# Altium project PIF_robot.PrjPcb
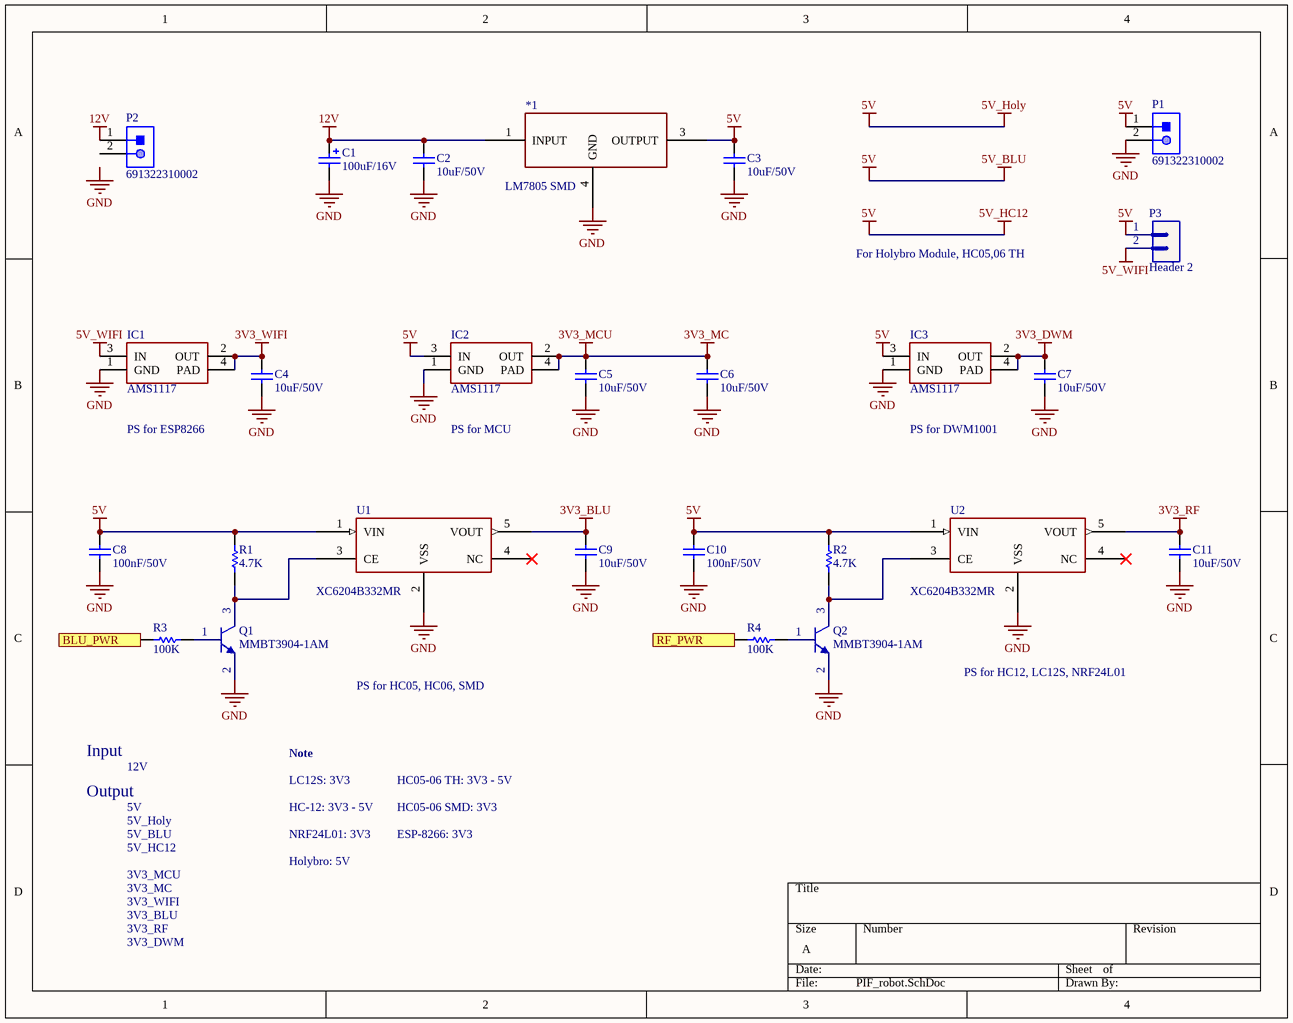
[diagram p0: PIF_robot.SchDoc]
7 sheets, 123 parts. Net scope: flat (ports and power ports of the same name join across sheets).
Board file: PIF_robot.PcbDoc
Sheets:
  PIF_robot.SchDoc
  wifi.SchDoc
  Decawave.schdoc
  Motor Control.SchDoc
  RF.SchDoc
  Sensor.SchDoc
  XCBMPUSche.schdoc

## Sheet PIF_robot.SchDoc
size A

### Parts
*1  LM7805 SMD  [LM7805 SMD]
C1  value 100uF/16V  [CAP-SM-AL-SIZE-D-D6L6]  (hidden comment: Cap-Al-100uF-16V-D6L5)
C2  value 10uF/50V  [CAP-SM-0805]  (hidden comment: Cap-10uF-50V-0805)
C3  value 10uF/50V  [CAP-SM-0805]  (hidden comment: Cap-10uF-50V-0805)
C4  value 10uF/50V  [CAP-SM-0805]  (hidden comment: Cap-10uF-50V-0805)
C5  value 10uF/50V  [CAP-SM-0805]  (hidden comment: Cap-10uF-50V-0805)
C6  value 10uF/50V  [CAP-SM-0805]  (hidden comment: Cap-10uF-50V-0805)
C7  value 10uF/50V  [CAP-SM-0805]  (hidden comment: Cap-10uF-50V-0805)
C8  value 100nF/50V  [CAP-SM-0805]  (hidden comment: Cap-100nF-50V-0805)
C9  value 10uF/50V  [CAP-SM-0805]  (hidden comment: Cap-10uF-50V-0805)
C10  value 100nF/50V  [CAP-SM-0805]  (hidden comment: Cap-100nF-50V-0805)
C11  value 10uF/50V  [CAP-SM-0805]  (hidden comment: Cap-10uF-50V-0805)
IC1  AMS1117  [SOT223]
IC2  AMS1117  [SOT223]
IC3  AMS1117  [SOT223]
P1  691322310002  [691322310002]
P2  691322310002  [691322310002]
P3  Header 2  [JP2]
Q1  MMBT3904-1AM  [SOT23_NEX]
Q2  MMBT3904-1AM  [SOT23_NEX]
R1  value 4.7K  [RES-SM-0805]  (hidden comment: Res-4.7K-0805)
R2  value 4.7K  [RES-SM-0805]  (hidden comment: Res-4.7K-0805)
R3  value 100K  [RES-SM-0805]  (hidden comment: Res-100K-0805)
R4  value 100K  [RES-SM-0805]  (hidden comment: Res-100K-0805)
U1  XC6204B332MR  [XC6204/05_SOT-00]
U2  XC6204B332MR  [XC6204/05_SOT-00]

### Ports
BLU_PWR (in), RF_PWR (in)

### Nets
3V3_BLU: C9.2 U1.5(VOUT)
3V3_DWM: C7.2 IC3.2(OUT) IC3.4(PAD)
3V3_MC: C5.2 C6.2 IC2.2(OUT) IC2.4(PAD)  [also labelled 3V3_MCU]
3V3_RF: C11.2 U2.5(VOUT)
3V3_WIFI: C4.2 IC1.2(OUT) IC1.4(PAD)
5V: *1.3(OUTPUT) C3.2 C8.2 C10.2 IC2.3(IN) IC3.3(IN) P1.1 P3.1 R1.2 R2.2 U1.1(VIN) U2.1(VIN)  [also labelled 5V_BLU, 5V_HC12, 5V_Holy]
5V_WIFI: IC1.3(IN) P3.2
12V: *1.1(INPUT) C1.1 C2.1 P2.1
GND: *1.4(GND) C1.2 C2.2 C3.1 C4.1 C5.1 C6.1 C7.1 C8.1 C9.1 C10.1 C11.1 IC1.1(GND) IC2.1(GND) IC3.1(GND) P1.2 Q1.2(E) Q2.2(E) U1.2(VSS) U2.2(VSS)
NetQ1_1: Q1.1(B) R3.2
NetQ1_3: Q1.3(C) R1.1 U1.3(CE)
NetQ2_1: Q2.1(B) R4.2
NetQ2_3: Q2.3(C) R2.1 U2.3(CE)
NetR3_1: R3.1 ; port BLU_PWR
NetR4_1: R4.1 ; port RF_PWR

Not connected (* = marked no-connect by the designer): P2 2; U1 4(NC)*; U2 4(NC)*

### Notes on the sheet
- For Holybro Module, HC05,06 TH
- PS for ESP8266
- PS for MCU
- PS for DWM1001
- PS for HC05, HC06, SMD
- PS for HC12, LC12S, NRF24L01
- Input
- 12V
- Note
- Output
- 5V_Holy
- 5V_BLU
- 5V
- LC12S: 3V3
- HC-12: 3V3 - 5V
- NRF24L01: 3V3
- HC05-06 TH: 3V3 - 5V
- HC05-06 SMD: 3V3
- ESP-8266: 3V3
- 5V_HC12
- 3V3_MC
- 3V3_MCU
- 3V3_WIFI
- Holybro: 5V
- 3V3_BLU
- 3V3_RF
- 3V3_DWM
- Labels drawn without touching a wire or pin: GND

### Library data of the parts
C1 = Cap-Al-100uF-16V-D6L5: CAP ALUM 100UF 20% 16V SMD; Manufacturer: Nichicon; Manufacturer Part Number: UWX1C101MCL1GB; Local Supplier: thegioiic; Local Supplier Link: https://thegioiic.com/products/tu-nhom-smd-100uf-16v-d6-3l5-4; Supplier 1: Digikey; Supplier 1 Part Number: 493-2105-1-ND; Supplier 1 Link: https://www.digikey.com/product-detail/en/nichicon/UWX1C101MCL1GB/493-2105-1-ND/590080
C2-C7 C9 C11 = Cap-10uF-50V-0805: CAP CER 10UF 50V X5R 0805; Manufacturer: Yageo; Manufacturer Part Number: CC0805KKX5R9BB106; Local Supplier: thegioiic; Local Supplier Link: https://thegioiic.com/products/tu-10uf-50v-0805; Supplier 1: Digikey; Supplier 1 Link: https://www.digikey.com/product-detail/en/yageo/CC0805KKX5R9BB106/311-3499-2-ND/7164383; Supplier 1 Part Number: 311-3499-2-ND
C8 C10 = Cap-100nF-50V-0805: CAP CER 0.1UF 50V Y5V 0805; Manufacturer: Samsung Electro-Mechanics; Manufacturer Part Number: CL21F104ZBCNNNC; Local Supplier: thegioiic; Local Supplier Link: https://thegioiic.com/products/tu-100nf-0-1uf-50v-0805; Supplier 1: Digikey; Supplier 1 Part Number: 1276-1007-1-ND; Supplier 1 Link: https://www.digikey.com/product-detail/en/samsung-electro-mechanics/CL21F104ZBCNNNC/1276-1007-1-ND/3889093
IC1-IC3 = AMS1117: Available in 1.8V, 2.5V, 2.85V, 3.3V, 5V, and  Adjustable Versions; Value: LM317
P1 P2 = 691322310002: WR-TBL Serie 322 Horizontal PCB Header, Pluggable, pitch 3.81mm, 2p; Compliance: RoHS; Modularity: No; Pin Number: 2; Rated Current [UL]: 10A; Working Voltage [UL]: 300VAC; ComponentLink1Description: Manufacturer; ComponentLink1URL: http://www.we-online.de; ComponentLink2URL: https://katalog.we-online.de/em/datasheet/691322310002.pdf; ComponentLink2Description: Datasheet; Mounting Technology: THT; Part Number: 691322310002; Packaging: Box; Operating Temperature: -40 to +105degC; PCB/Cable/Panel: PCB; Pitch: 3.81mm; Published Date: October 2019; Type: Horizontal; Publisher: Wurth Elektronik; Application: Pluggable
P3 = Header 2: Header, 2-Pin; LatestRevisionDate: 17-Jul-2002; LatestRevisionNote: Re-released for DXP Platform.; Publisher: Altium Limited
R1 R2 = Res-4.7K-0805: RES SMD 4.7K OHM 5% 1/8W 0805; Manufacturer: Yageo; Manufacturer Part Number: RC0805JR-074K7L; Local Supplier: thegioiic; Local Supplier Link: https://thegioiic.com/products/dien-tro-4-7k-ohm-0805-5; Supplier 1: Digikey; Supplier 1 Link: https://www.digikey.com/product-detail/en/yageo/RC0805JR-074K7L/311-4.7KARCT-ND/731274; Supplier 1 Part Number: 311-4.7KARCT-ND
R3 R4 = Res-100K-0805: RES 0 OHM JUMPER 0805; Manufacturer: Vishay Dale; Manufacturer Part Number: WSL080500000ZEA9; Local Supplier: thegioiic; Local Supplier Link: https://thegioiic.com/products/dien-tro-0-ohm-0805-5; Supplier 1: Digikey; Supplier 1 Link: https://www.digikey.com/product-detail/en/vishay-dale/WSL080500000ZEA9/541-3928-1-ND/7423223; Supplier 1 Part Number: 541-3928-1-ND
U1 U2 = XC6204B332MR: Vendor: Torex Semiconductor; Built_By: EMA_UL_Team; SourceLibrary: Torex_2016-07-05_1; Manufacturer_Part_Number: XC6204B332MR; Copyright: Copyright (C) 2018 Accelerated Designs. All rights reserved; RefDes: RefDes; Type: DEV
*1 = LM7805 SMD: Local Supplier: *; Local Supplier Link: *; Local Supplier Part Number: *; Mannufacture: *; Mannufacture Part Number: *

## Sheet wifi.SchDoc
size A
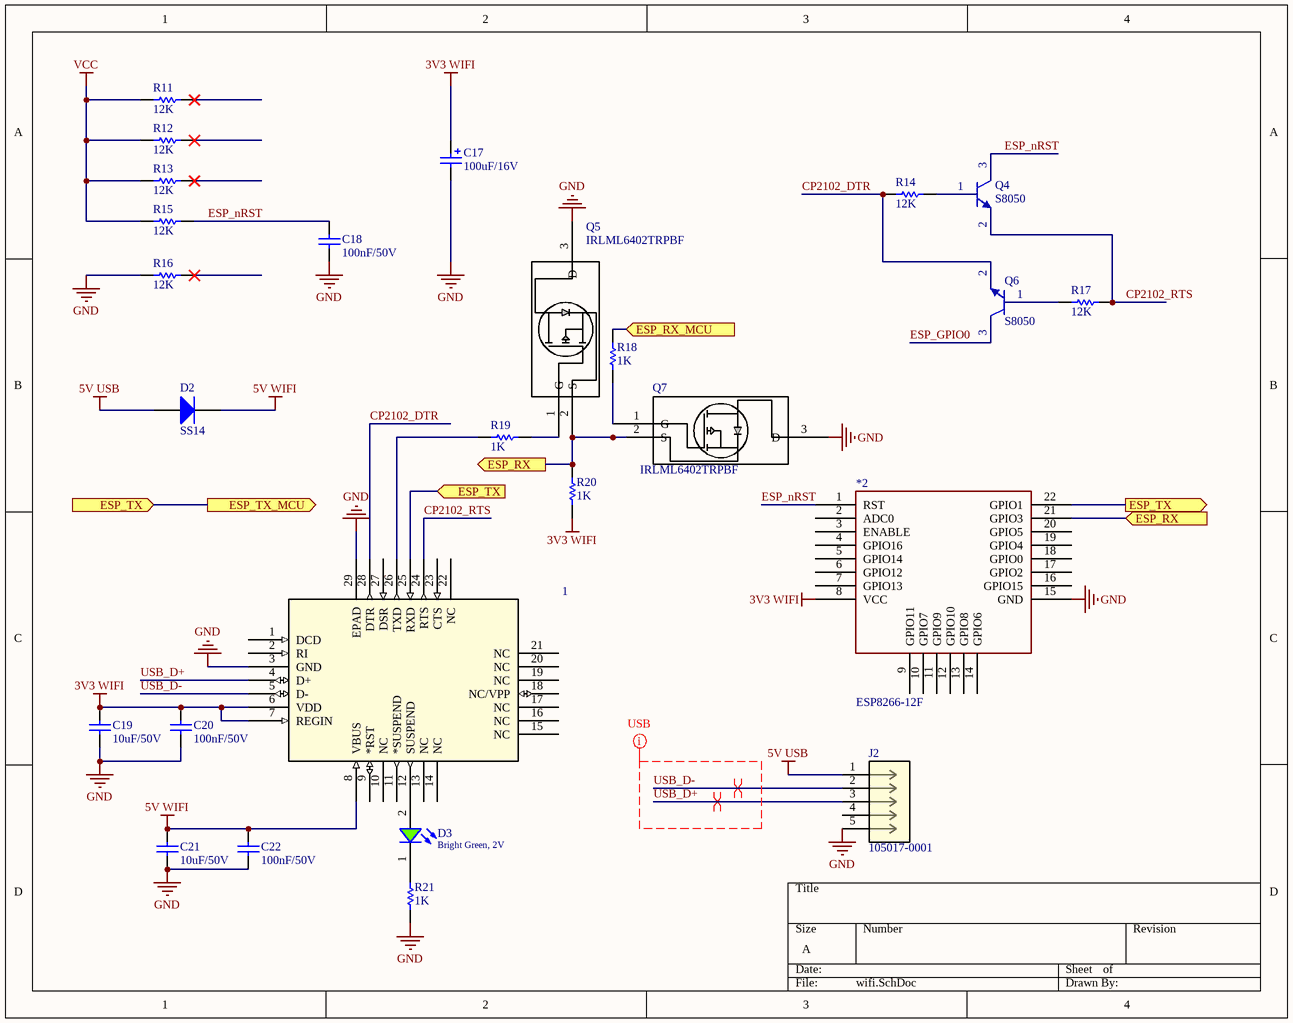
[diagram p1: wifi.SchDoc]

### Parts
1  (no value)  [QFN28_5X5_SIL]
*2  ESP8266-12F  [ESP8266-12F]
C17  value 100uF/16V  [CAP_SM_TAN]  (hidden comment: TAJB107M006RNJ)
C18  value 100nF/50V  [CAP-SM-0805]  (hidden comment: Cap-100nF-50V-0805)
C19  value 10uF/50V  [CAP-SM-0805]  (hidden comment: Cap-10uF-50V-0805)
C20  value 100nF/50V  [CAP-SM-0805]  (hidden comment: Cap-100nF-50V-0805)
C21  value 10uF/50V  [CAP-SM-0805]  (hidden comment: Cap-10uF-50V-0805)
C22  value 100nF/50V  [CAP-SM-0805]  (hidden comment: Cap-100nF-50V-0805)
D2  SS14  [SS14]
D3  Bright Green, 2V  [WL-SMCW_0805]
J2  105017-0001  [CONN_105017-0001]
Q4  S8050  [SOT23_NEX]
Q5  IRLML6402TRPBF  [SOT23_INF]
Q6  S8050  [SOT23_NEX]
Q7  IRLML6402TRPBF  [SOT23_INF]
R11  value 12K  [RES-SM-0805]  (hidden comment: Res-12K-0805)
R12  value 12K  [RES-SM-0805]  (hidden comment: Res-12K-0805)
R13  value 12K  [RES-SM-0805]  (hidden comment: Res-12K-0805)
R14  value 12K  [RES-SM-0805]  (hidden comment: Res-12K-0805)
R15  value 12K  [RES-SM-0805]  (hidden comment: Res-12K-0805)
R16  value 12K  [RES-SM-0805]  (hidden comment: Res-12K-0805)
R17  value 12K  [RES-SM-0805]  (hidden comment: Res-12K-0805)
R18  value 1K  [RES-SM-0805]  (hidden comment: Res-1K-0805)
R19  value 1K  [RES-SM-0805]  (hidden comment: Res-1K-0805)
R20  value 1K  [RES-SM-0805]  (hidden comment: Res-1K-0805)
R21  value 1K  [RES-SM-0805]  (hidden comment: Res-1K-0805)

### Ports
ESP_RX (in), ESP_RX (out), ESP_RX_MCU (in), ESP_TX (in), ESP_TX (out), ESP_TX_MCU (out)

### Nets
3V3 WIFI: 1.6(VDD) 1.7(REGIN) *2.8(VCC) C17.1 C19.2 C20.2 R20.1
5V USB: D2.2(A) J2.1
5V WIFI: 1.8(VBUS) C21.2 C22.2 D2.1(K)
GND: 1.3(GND) 1.29(EPAD) *2.15(GND) C17.2 C18.1 C19.1 C20.1 C21.1 C22.1 J2.5 Q5.3(D) Q7.3(D) R16.1 R21.1
VCC: R11.1 R12.1 R13.1 R15.1
CP2102_DTR: 1.28(DTR) Q6.2(E) R14.1
CP2102_RTS: 1.24(RTS) Q4.2(E) R17.2
ESP_GPIO0: Q6.3(C)
ESP_nRST: *2.1(RST) C18.2 Q4.3(C) R15.2
USB_D+: 1.4(D+) J2.3
USB_D-: 1.5(D-) J2.2
Net1_12: 1.12(SUSPEND) D3.2(A)
Net1_25: 1.25(RXD) *2.22(GPIO1) ; port ESP_TX, port ESP_TX_MCU
Net1_26: 1.26(TXD) R19.1
Net*2_21: *2.21(GPIO3) Q5.2(S) Q7.2(S) R20.2 ; port ESP_RX
NetD3_1: D3.1(K) R21.2
NetQ4_1: Q4.1(B) R14.2
NetQ5_1: Q5.1(G) R19.2
NetQ6_1: Q6.1(B) R17.1
NetQ7_1: Q7.1(G) R18.2
NetR18_1: R18.1 ; port ESP_RX_MCU

Not connected (* = marked no-connect by the designer): 1 1(DCD) 2(RI) 9(*RST) 10(NC) 11(*SUSPEND) 13(NC) 14(NC) 15(NC) 16(NC) 17(NC) 18(NC/VPP) 19(NC) 20(NC) 21(NC) 22(NC) 23(CTS) 27(DSR); *2 2(ADC0) 3(ENABLE) 4(GPIO16) 5(GPIO14) 6(GPIO12) 7(GPIO13) 9(GPIO11) 10(GPIO7) 11(GPIO9) 12(GPIO10) 13(GPIO8) 14(GPIO6) 16(GPIO15) 17(GPIO2) 18(GPIO0) 19(GPIO4) 20(GPIO5); J2 4; R11 2*; R12 2*; R13 2*; R16 2*

### Layout directives
differential pair: USB_D+, USB_D-
mark named USB: USB_D+, USB_D-

### Library data of the parts
1 = CP2102-GM: No Description Available; Vendor: Silicon Labs; Built_By: EMA_UL_Team; SourceLibrary: Silicon_Labs_2015-03-23; Manufacturer_Part_Number: CP2102-GM; Copyright: Copyright (C) 2018 Accelerated Designs. All rights reserved; RefDes: RefDes; Type: DEV
C17 = Cap-Tan-100uF-16V: Manufacturer: Nichicon; Manufacturer Part Number: UWX1C101MCL1GB; Local Supplier: icdayroi; Local Supplier Link: https://icdayroi.com/tu-tantalum-100uf-16v-smd6032; Supplier 1: Digikey; Supplier 1 Part Number: 493-2105-1-ND; Supplier 1 Link: https://www.digikey.com/product-detail/en/nichicon/UWX1C101MCL1GB/493-2105-1-ND/590080
C18 C20 C22 = Cap-100nF-50V-0805: as C8 on sheet PIF_robot; Local Supplier: thegioiic; Local Supplier Link: https://thegioiic.com/products/tu-100nf-0-1uf-50v-0805; Supplier 1: Digikey; Supplier 1 Part Number: 1276-1007-1-ND; Supplier 1 Link: https://www.digikey.com/product-detail/en/samsung-electro-mechanics/CL21F104ZBCNNNC/1276-1007-1-ND/3889093
C19 C21 = Cap-10uF-50V-0805: as C2 on sheet PIF_robot; Local Supplier: thegioiic; Local Supplier Link: https://thegioiic.com/products/tu-10uf-50v-0805; Supplier 1: Digikey; Supplier 1 Link: https://www.digikey.com/product-detail/en/yageo/CC0805KKX5R9BB106/311-3499-2-ND/7164383; Supplier 1 Part Number: 311-3499-2-ND
D2 = Diode-SS14: DIODE SCHOTTKY 40V 1A SMA; Manufacturer: ON Semiconductor; Local Supplier: thegioiic; Local Supplier Link: https://thegioiic.com/products/ss14-sma; Supplier 1: Digikey; Supplier 1 Link: https://www.digikey.com/product-detail/en/on-semiconductor/SS14/SS14CT-ND/965729; Manufacturer Part Number: SS14; Supplier 1 Part Number: SS14CT-ND
D3 = 150080VS75000: WL-SMCW SMT Mono-color Chip LED Waterclear, size 0805, Bright Green, 2V, 140deg; Chip Technology: AlInGaP; Dominant Wavelength typ.: 570nm; Luminous Intensity typ.: 40mcd; Peak Wavelength typ.: 572nm; Viewing Angle: 140deg; ComponentLink1Description: Manufacturer; ComponentLink1URL: http://www.we-online.de; ComponentLink2URL: https://www.we-online.com/catalog/datasheet/150080VS75000.pdf; ComponentLink2Description: Datasheet; Forward Voltage typ.: 2V; Emitting Color: Bright Green; Mounting Technology: SMT; Operating Temperature: -40 to +85degC; Published Date: December 2019; Part Number: 150080VS75000; Packaging: Tape and Reel; Size: 0805; Publisher: Wurth Elektronik
J2 = 105017-0001: No Description Available; Vendor: Molex Connector Corporation; Built_By: EMA_Cory; SourceLibrary: Molex_2020-05-26; Datasheet: https://www.molex.com/pdm_docs/sd/1050170001_sd.pdf; Manufacturer_Part_Number: 105017-0001; Copyright: Copyright (C) 2018 Accelerated Designs. All rights reserved; RefDes: RefDes; Type: DEV
Q5 Q7 = IRLML6402TRPBF: No Description Available; Source_Library: Infineon_2020-02-27.xlr; Built_By: EMA_Justin; SourceLibrary: Infineon_2020-02-27; Vendor: Infineon; Type: DEV; Copyright: Copyright (C) 2018 Accelerated Designs. All rights reserved; Manufacturer_Part_Number: IRLML6402TRPBF; RefDes: RefDes
R11-R17 = Res-12K-0805: RES 12 KOHM JUMPER 0805; Manufacturer: Vishay Thin Film; Manufacturer Part Number: PAT0805E3121BST1; Local Supplier: icdayroi; Local Supplier Link: https://icdayroi.com/dien-tro-12k-0805-1-goi-50-con; Supplier 1: Digikey; Supplier 1 Link: https://www.digikey.com/product-detail/en/vishay-thin-film/PAT0805E3121BST1/PAT0805E3121BST1-ND/2281536; Supplier 1 Part Number: PAT0805E3121BST1-ND
R18-R21 = Res-1K-0805: RES 1K OHM 1% 1/4W 0805; Manufacturer: Stackpole Electronics Inc; Manufacturer Part Number: RNCP0805FTD1K00; Local Supplier: thegioiic; Local Supplier Link: https://thegioiic.com/products/dien-tro-1k-ohm-0805-5; Supplier 1: Digikey; Supplier 1 Link: https://www.digikey.com/product-detail/en/stackpole-electronics-inc/RNCP0805FTD1K00/RNCP0805FTD1K00CT-ND/2240568; Supplier 1 Part Number: RNCP0805FTD1K00CT-ND
*2 = ESP8266-12F: Local Supplier: HShop; Local Supplier Link: https://hshop.vn/products/mach-thu-phat-wifi-soc-esp8266-v12; Local Supplier Part Number: HS000912; Manufacturer: *; Manufacturer Part Number: *

## Sheet Decawave.schdoc
size A
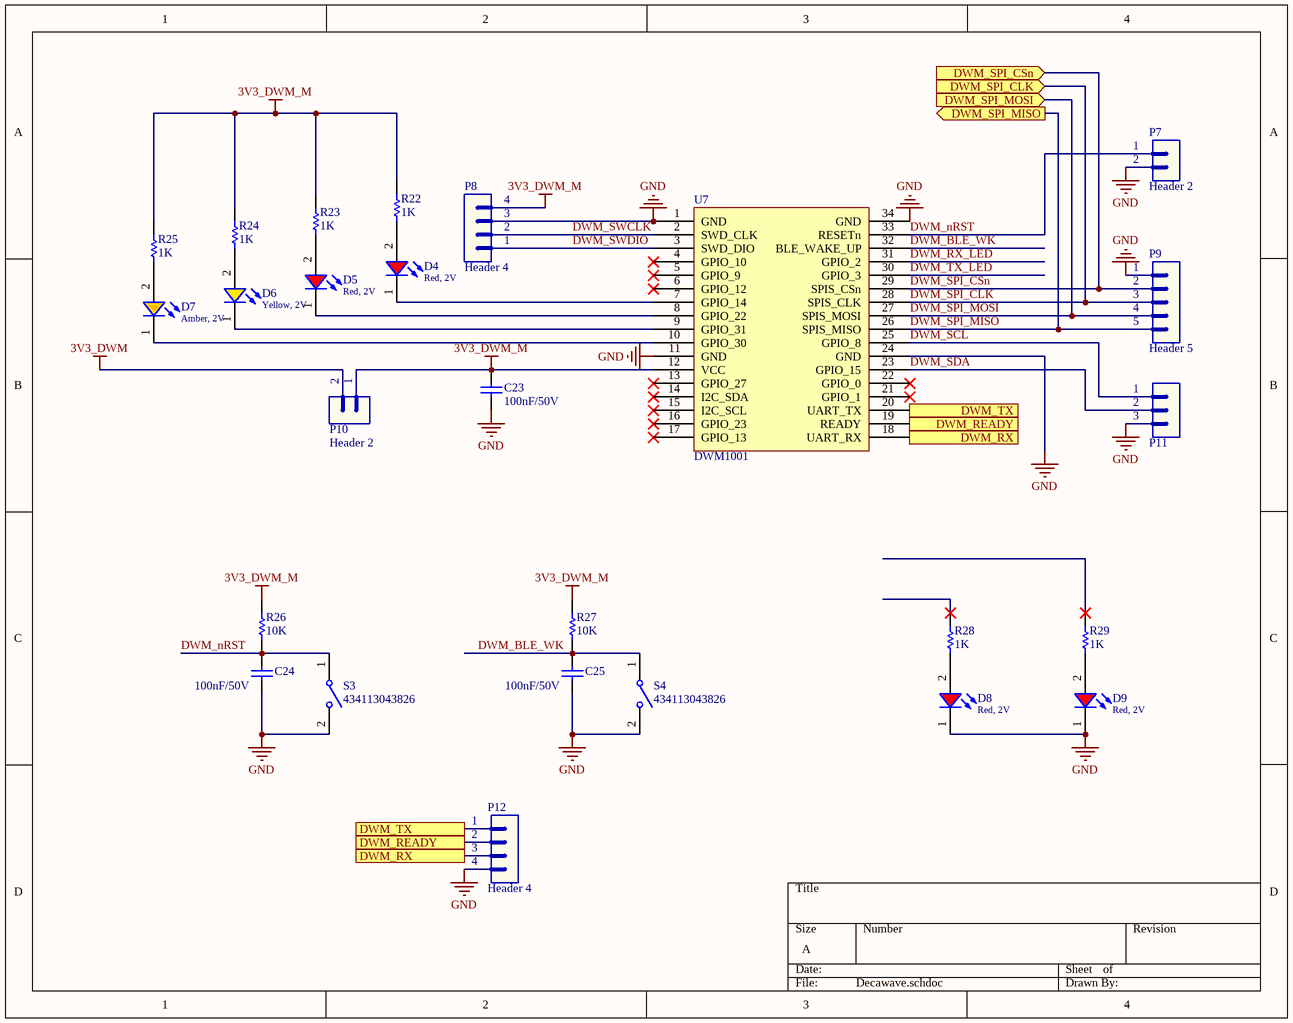
[diagram p2: Decawave.schdoc]

### Parts
C23  value 100nF/50V  [CAP-SM-0805]  (hidden comment: Cap-100nF-50V-0805)
C24  value 100nF/50V  [CAP-SM-0805]  (hidden comment: Cap-100nF-50V-0805)
C25  value 100nF/50V  [CAP-SM-0805]  (hidden comment: Cap-100nF-50V-0805)
D4  Red, 2V  [WL-SMCW_0805]
D5  Red, 2V  [WL-SMCW_0805]
D6  Yellow, 2V  [WL-SMCW_0805]
D7  Amber, 2V  [WL-SMCW_0805]
D8  Red, 2V  [WL-SMCW_0805]
D9  Red, 2V  [WL-SMCW_0805]
P7  Header 2  [JP2]
P8  Header 4  [JP4]
P9  Header 5  [JP5]
P10  Header 2  [JP2]
P11  Header 3  [JP3]  (value not drawn)
P12  Header 4  [JP4]
R22  value 1K  [RES-SM-0805]  (hidden comment: Res-1K-0805)
R23  value 1K  [RES-SM-0805]  (hidden comment: Res-1K-0805)
R24  value 1K  [RES-SM-0805]  (hidden comment: Res-1K-0805)
R25  value 1K  [RES-SM-0805]  (hidden comment: Res-1K-0805)
R26  value 10K  [RES-SM-0805]  (hidden comment: Res-10k-0805)
R27  value 10K  [RES-SM-0805]  (hidden comment: Res-10k-0805)
R28  value 1K  [RES-SM-0805]  (hidden comment: Res-1K-0805)
R29  value 1K  [RES-SM-0805]  (hidden comment: Res-1K-0805)
S3  434113043826  [434113043826]
S4  434113043826  [434113043826]
U7  DWM1001  [DWM1001]

### Ports
DWM_READY (in), DWM_READY (out), DWM_RX (in), DWM_RX (out), DWM_SPI_CLK (in), DWM_SPI_CSn (in), DWM_SPI_MISO (out), DWM_SPI_MOSI (in), DWM_TX (in), DWM_TX (out)

### Nets
3V3_DWM: P10.2
3V3_DWM_M: C23.2 P8.4 P10.1 R22.2 R23.2 R24.2 R25.2 R26.2 R27.2 U7.12(VCC)
GND: C23.1 C24.2 C25.2 D8.1(K) D9.1(K) P7.2 P8.3 P9.1 P11.3 P12.4 S3.2 S4.2 U7.1(GND) U7.11(GND) U7.24(GND) U7.34(GND)
DWM_BLE_WK: C25.1 R27.1 S4.1 U7.32(BLE_WAKE_UP)
DWM_nRST: C24.1 P7.1 R26.1 S3.1 U7.33(RESETn)
DWM_RX_LED: U7.31(GPIO_2)
DWM_SCL: P11.1 U7.25(GPIO_8)
DWM_SDA: P11.2 U7.23(GPIO_15)
DWM_SPI_CLK: P9.3 U7.28(SPIS_CLK) ; port DWM_SPI_CLK
DWM_SPI_CSn: P9.2 U7.29(SPIS_CSn) ; port DWM_SPI_CSn
DWM_SPI_MISO: P9.5 U7.26(SPIS_MISO) ; port DWM_SPI_MISO
DWM_SPI_MOSI: P9.4 U7.27(SPIS_MOSI) ; port DWM_SPI_MOSI
DWM_SWCLK: P8.2 U7.2(SWD_CLK)
DWM_SWDIO: P8.1 U7.3(SWD_DIO)
DWM_TX_LED: U7.30(GPIO_3)
NetD4_1: D4.1(K) U7.7(GPIO_14)
NetD4_2: D4.2(A) R22.1
NetD5_1: D5.1(K) U7.8(GPIO_22)
NetD5_2: D5.2(A) R23.1
NetD6_1: D6.1(K) U7.9(GPIO_31)
NetD6_2: D6.2(A) R24.1
NetD7_1: D7.1(K) U7.10(GPIO_30)
NetD7_2: D7.2(A) R25.1
NetD8_2: D8.2(A) R28.1
NetD9_2: D9.2(A) R29.1
NetP12_1: P12.1 U7.20(UART_TX) ; port DWM_TX
NetP12_2: P12.2 U7.19(READY) ; port DWM_READY
NetP12_3: P12.3 U7.18(UART_RX) ; port DWM_RX

Not connected (* = marked no-connect by the designer): R28 2*; R29 2*; U7 4(GPIO_10)* 5(GPIO_9)* 6(GPIO_12)* 13(GPIO_27)* 14(I2C_SDA)* 15(I2C_SCL)* 16(GPIO_23)* 17(GPIO_13)* 21(GPIO_1)* 22(GPIO_0)*

### Library data of the parts
C23-C25 = Cap-100nF-50V-0805: as C8 on sheet PIF_robot; Local Supplier: thegioiic; Local Supplier Link: https://thegioiic.com/products/tu-100nf-0-1uf-50v-0805; Supplier 1: Digikey; Supplier 1 Part Number: 1276-1007-1-ND; Supplier 1 Link: https://www.digikey.com/product-detail/en/samsung-electro-mechanics/CL21F104ZBCNNNC/1276-1007-1-ND/3889093
D4 D5 D8 D9 = 150080RS75000: WL-SMCW SMT Mono-color Chip LED Waterclear, size 0805, Red, 2V, 140deg; Chip Technology: AlInGaP; Dominant Wavelength typ.: 625nm; Luminous Intensity typ.: 150mcd; Peak Wavelength typ.: 630nm; Viewing Angle: 140deg; ComponentLink1Description: Manufacturer; ComponentLink1URL: http://www.we-online.de; ComponentLink2URL: https://www.we-online.com/catalog/datasheet/150080RS75000.pdf; ComponentLink2Description: Datasheet; Forward Voltage typ.: 2V; Emitting Color: Red; Mounting Technology: SMT; Operating Temperature: -40 to +85degC; Published Date: December 2019; Part Number: 150080RS75000; Packaging: Tape and Reel; Size: 0805; Publisher: Wurth Elektronik
D6 = 150080YS75000: WL-SMCW SMT Mono-color Chip LED Waterclear, size 0805, Yellow, 2V, 140deg; Chip Technology: AlInGaP; Dominant Wavelength typ.: 590nm; Luminous Intensity typ.: 120mcd; Peak Wavelength typ.: 595nm; Viewing Angle: 140deg; ComponentLink1Description: Manufacturer; ComponentLink1URL: http://www.we-online.de; ComponentLink2URL: https://www.we-online.com/catalog/datasheet/150080YS75000.pdf; ComponentLink2Description: Datasheet; Forward Voltage typ.: 2V; Emitting Color: Yellow; Mounting Technology: SMT; Operating Temperature: -40 to +85degC; Published Date: December 2019; Part Number: 150080YS75000; Packaging: Tape and Reel; Size: 0805; Publisher: Wurth Elektronik
D7 = 150080AS75000: WL-SMCW SMT Mono-color Chip LED Waterclear, size 0805, Amber, 2V, 140deg; Chip Technology: AlInGaP; Dominant Wavelength typ.: 605nm; Luminous Intensity typ.: 130mcd; Peak Wavelength typ.: 610nm; Viewing Angle: 140deg; ComponentLink1Description: Manufacturer; ComponentLink1URL: http://www.we-online.de; ComponentLink2URL: https://www.we-online.com/catalog/datasheet/150080AS75000.pdf; ComponentLink2Description: Datasheet; Forward Voltage typ.: 2V; Emitting Color: Amber; Mounting Technology: SMT; Operating Temperature: -40 to +85degC; Published Date: December 2019; Part Number: 150080AS75000; Packaging: Tape and Reel; Size: 0805; Publisher: Wurth Elektronik
P7 P10 = Header 2: Header, 2-Pin; LatestRevisionDate: 17-Jul-2002; LatestRevisionNote: Re-released for DXP Platform.; Publisher: Altium Limited
P8 P12 = Header 4: Header, 4-Pin; LatestRevisionDate: 17-Jul-2002; LatestRevisionNote: Re-released for DXP Platform.; Publisher: Altium Limited
P9 = Header 5: Header, 5-Pin; LatestRevisionDate: 17-Jul-2002; LatestRevisionNote: Re-released for DXP Platform.; Publisher: Altium Limited
P11 = Header 3: Header, 3-Pin; LatestRevisionDate: 17-Jul-2002; LatestRevisionNote: Re-released for DXP Platform.; Publisher: Altium Limited
R22-R25 R28 R29 = Res-1K-0805: as R18 on sheet wifi; Local Supplier: thegioiic; Local Supplier Link: https://thegioiic.com/products/dien-tro-1k-ohm-0805-5; Supplier 1: Digikey; Supplier 1 Link: https://www.digikey.com/product-detail/en/stackpole-electronics-inc/RNCP0805FTD1K00/RNCP0805FTD1K00CT-ND/2240568; Supplier 1 Part Number: RNCP0805FTD1K00CT-ND
R26 R27 = Res-10k-0805: RES 10K OHM 1% 1/4W 0805; Manufacturer: Stackpole Electronics Inc; Manufacturer Part Number: RNCP0805FTD10K0; Local Supplier: thegioiic; Local Supplier Link: https://thegioiic.com/products/dien-tro-10k-ohm-0805-5; Supplier 1: Digikey; Supplier 1 Link: https://www.digikey.com/product-detail/en/stackpole-electronics-inc/RNCP0805FTD10K0/RNCP0805FTD10K0CT-ND/2240601; Supplier 1 Part Number: RNCP0805FTD10K0CT-ND
S3 S4 = 434113043826: WS-TASV J-Bend SMT Tact Switch 6x3.5mm, height 4.3mm, 260gf; Rated Voltage: 12VDC; Rated Current: 50mA; Washable: No; ComponentLink1Description: Manufacturer; ComponentLink1URL: http://www.we-online.de; ComponentLink2Description: Datasheet; ComponentLink2URL: https://katalog.we-online.com/em/datasheet/434113043826.pdf; Operating Temperature: -40 to +85degC; Part Number: 434113043826; Published Date: September 2019; Contact Material: Stainless Steel; Height: 4.3mm; Mounting Technology: SMT; Contact Plating: Silver; Operation Force: 260gf; Packaging: Tape and Reel; Terminal Material: Copper Alloy; Publisher: Wurth Elektronik; Terminal Plating: Silver

## Sheet Motor Control.SchDoc
size A
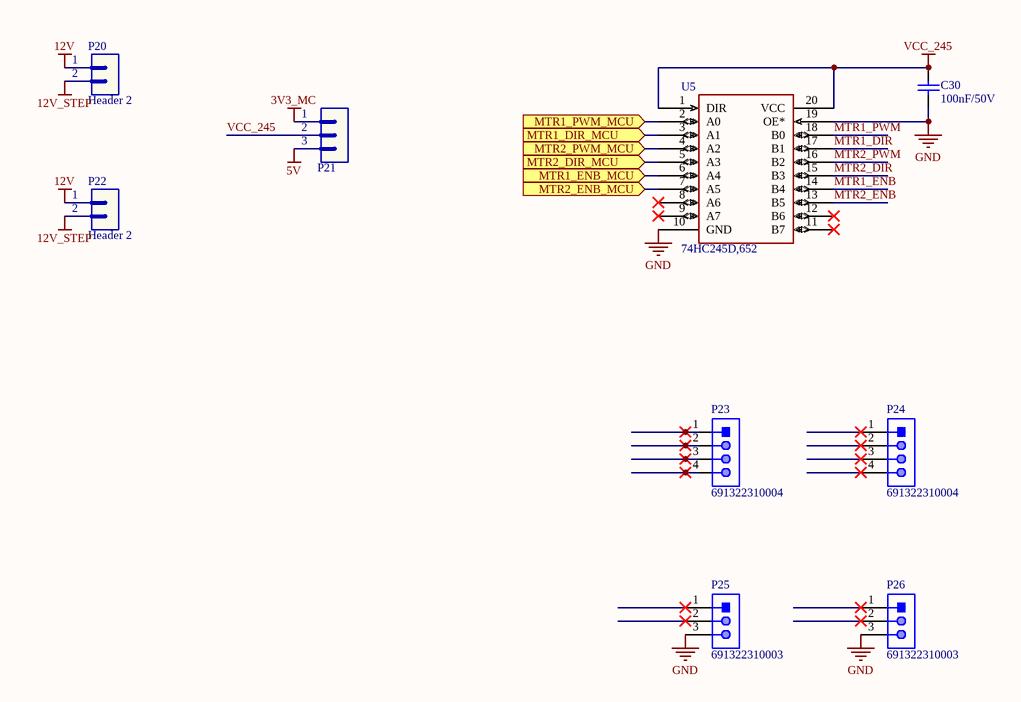
[diagram p3: Motor Control.SchDoc]

### Parts
C30  value 100nF/50V  [CAP-SM-0805]  (hidden comment: Cap-100nF-50V-0805)
P20  Header 2  [JP2]
P21  Header 3  [JP3]  (value not drawn)
P22  Header 2  [JP2]
P23  691322310004  [691322310004]
P24  691322310004  [691322310004]
P25  691322310003  [691322310003]
P26  691322310003  [691322310003]
U5  74HC245D,652  [SOT163-1_NEX]

### Ports
MTR1_DIR_MCU (in), MTR1_ENB_MCU (in), MTR1_PWM_MCU (in), MTR2_DIR_MCU (in), MTR2_ENB_MCU (in), MTR2_PWM_MCU (in)

### Nets
3V3_MC: P21.1
5V: P21.3
12V: P20.1 P22.1
12V_STEP: P20.2 P22.2
GND: C30.1 P25.3 P26.3 U5.10(GND) U5.19(OE*)
VCC_245: C30.2 P21.2 U5.1(DIR) U5.20(VCC)
MTR1_DIR: U5.17(B1)
MTR1_ENB: U5.14(B4)
MTR1_PWM: U5.18(B0)
MTR2_DIR: U5.15(B3)
MTR2_ENB: U5.13(B5)
MTR2_PWM: U5.16(B2)
NetU3_3: U5.3(A1) ; port MTR1_DIR_MCU
NetU3_4: U5.6(A4) ; port MTR1_ENB_MCU
NetU3_5: U5.5(A3) ; port MTR2_DIR_MCU
NetU3_6: U5.7(A5) ; port MTR2_ENB_MCU
NetU3_10: U5.2(A0) ; port MTR1_PWM_MCU
NetU3_11: U5.4(A2) ; port MTR2_PWM_MCU

Not connected (* = marked no-connect by the designer): P23 1* 2* 3* 4*; P24 1* 2* 3* 4*; P25 1* 2*; P26 1* 2*; U5 8(A6)* 9(A7)* 11(B7)* 12(B6)*

### Library data of the parts
C30 = Cap-100nF-50V-0805: as C8 on sheet PIF_robot; Local Supplier: thegioiic; Local Supplier Link: https://thegioiic.com/products/tu-100nf-0-1uf-50v-0805; Supplier 1: Digikey; Supplier 1 Part Number: 1276-1007-1-ND; Supplier 1 Link: https://www.digikey.com/product-detail/en/samsung-electro-mechanics/CL21F104ZBCNNNC/1276-1007-1-ND/3889093
P20 P22 = Header 2: Header, 2-Pin; LatestRevisionDate: 17-Jul-2002; LatestRevisionNote: Re-released for DXP Platform.; Publisher: Altium Limited
P21 = Header 3: Header, 3-Pin; LatestRevisionDate: 17-Jul-2002; LatestRevisionNote: Re-released for DXP Platform.; Publisher: Altium Limited
P23 P24 = 691322310004: WR-TBL Serie 322 Horizontal PCB Header, Pluggable, pitch 3.81mm, 4p; Compliance: RoHS; Modularity: No; Pin Number: 4; Rated Current [UL]: 10A; Working Voltage [UL]: 300VAC; ComponentLink1Description: Manufacturer; ComponentLink1URL: http://www.we-online.de; ComponentLink2URL: https://katalog.we-online.de/em/datasheet/691322310004.pdf; ComponentLink2Description: Datasheet; Mounting Technology: THT; Part Number: 691322310004; Packaging: Box; Operating Temperature: -40 to +105degC; PCB/Cable/Panel: PCB; Pitch: 3.81mm; Published Date: October 2019; Type: Horizontal; Publisher: Wurth Elektronik; Application: Pluggable
P25 P26 = 691322310003: WR-TBL Serie 322 Horizontal PCB Header, Pluggable, pitch 3.81mm, 3p; Compliance: RoHS; Modularity: No; Pin Number: 3; Rated Current [UL]: 10A; Working Voltage [UL]: 300VAC; ComponentLink1Description: Manufacturer; ComponentLink1URL: http://www.we-online.de; ComponentLink2URL: https://katalog.we-online.de/em/datasheet/691322310003.pdf; ComponentLink2Description: Datasheet; Mounting Technology: THT; Part Number: 691322310003; Packaging: Box; Operating Temperature: -40 to +105degC; PCB/Cable/Panel: PCB; Pitch: 3.81mm; Published Date: October 2019; Type: Horizontal; Publisher: Wurth Elektronik; Application: Pluggable

## Sheet RF.SchDoc
size A
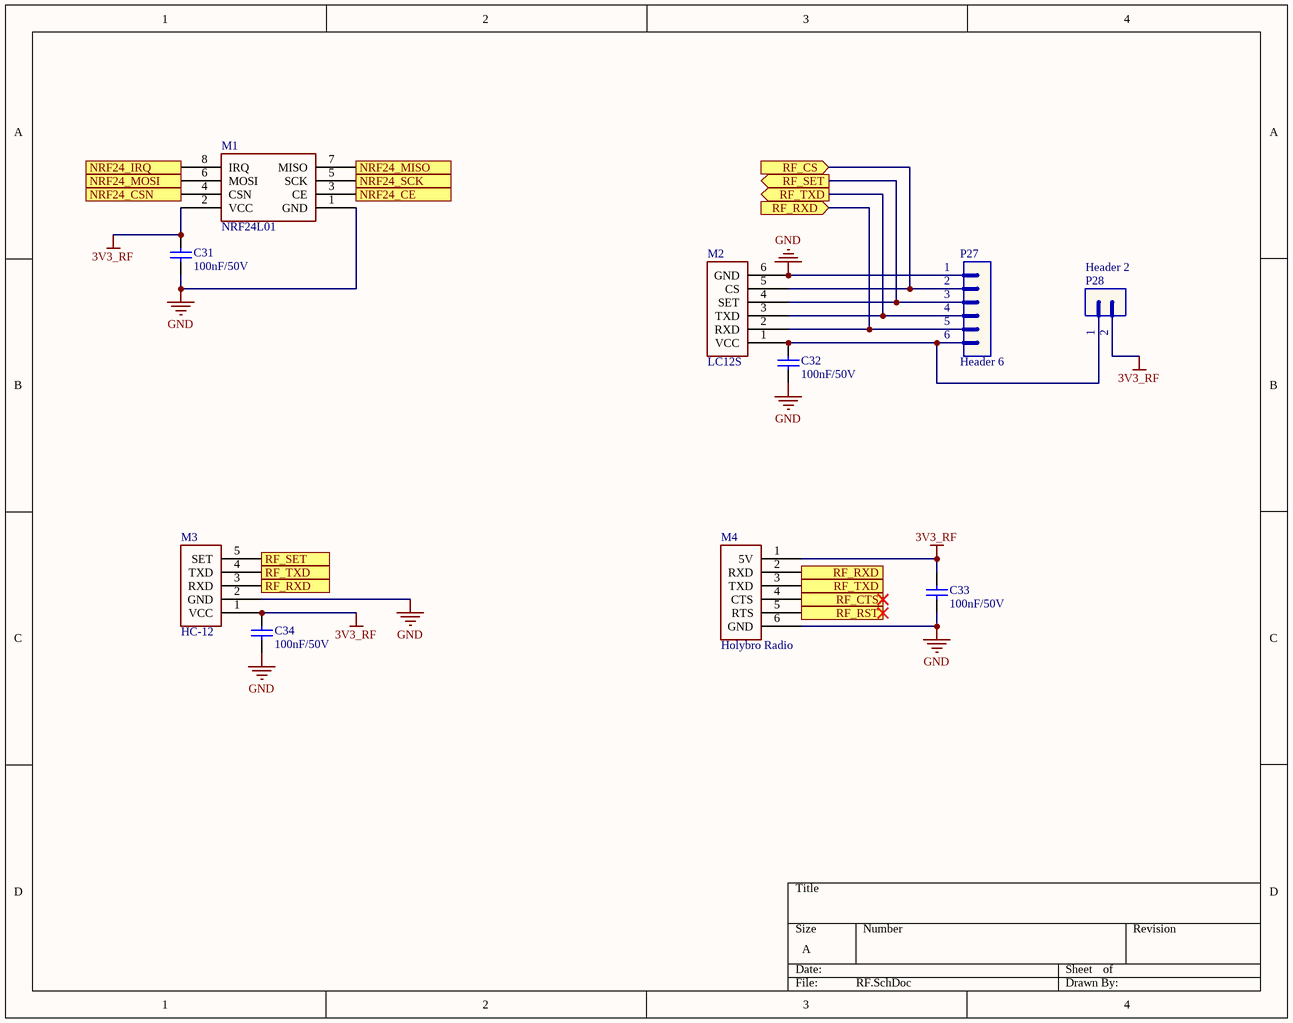
[diagram p4: RF.SchDoc]

### Parts
C31  value 100nF/50V  [CAP-SM-0805]  (hidden comment: Cap-100nF-50V-0805)
C32  value 100nF/50V  [CAP-SM-0805]  (hidden comment: Cap-100nF-50V-0805)
C33  value 100nF/50V  [CAP-SM-0805]  (hidden comment: Cap-100nF-50V-0805)
C34  value 100nF/50V  [CAP-SM-0805]  (hidden comment: Cap-100nF-50V-0805)
M1  NRF24L01  [NRF24L01]
M2  LC12S  [LC12S]
M3  HC-12  [HC-12]
M4  Holybro Radio  [Holybro-Radio]
P27  Header 6  [JP6]
P28  Header 2  [JP2]

### Ports
NRF24_CE (in), NRF24_CSN (in), NRF24_IRQ (out), NRF24_MISO (out), NRF24_MOSI (in), NRF24_SCK (in), RF_CS (in), RF_CTS (in), RF_RST (out), RF_RXD (in), RF_RXD (out), RF_SET (out), RF_TXD (in), RF_TXD (out)

### Nets
3V3_RF: C31.2 C33.2 C34.2 M1.2(VCC) M3.1(VCC) M4.1(5V) P28.2
GND: C31.1 C32.1 C33.1 C34.1 M1.1(GND) M2.6(GND) M3.2(GND) M4.6(GND) P27.1
BOOT1: M2.4(SET) M3.5(SET) P27.3 ; port RF_SET
NetC32_2: C32.2 M2.1(VCC) P27.6 P28.1
NetM1_3: M1.3(CE) ; port NRF24_CE
NetM1_4: M1.4(CSN) ; port NRF24_CSN
NetM1_5: M1.5(SCK) ; port NRF24_SCK
NetM1_6: M1.6(MOSI) ; port NRF24_MOSI
NetM1_7: M1.7(MISO) ; port NRF24_MISO
NetM1_8: M1.8(IRQ) ; port NRF24_IRQ
NetM2_2: M2.2(RXD) M3.3(RXD) M4.2(RXD) P27.5 ; port RF_RXD
NetM2_3: M2.3(TXD) M3.4(TXD) M4.3(TXD) P27.4 ; port RF_TXD
NetM2_5: M2.5(CS) P27.2 ; port RF_CS
NetM4_4: M4.4(CTS) ; port RF_CTS
NetM4_5: M4.5(RTS) ; port RF_RST

### Library data of the parts
C31-C34 = Cap-100nF-50V-0805: as C8 on sheet PIF_robot; Local Supplier: thegioiic; Local Supplier Link: https://thegioiic.com/products/tu-100nf-0-1uf-50v-0805; Supplier 1: Digikey; Supplier 1 Part Number: 1276-1007-1-ND; Supplier 1 Link: https://www.digikey.com/product-detail/en/samsung-electro-mechanics/CL21F104ZBCNNNC/1276-1007-1-ND/3889093
P27 = Header 6: Header, 6-Pin; LatestRevisionDate: 17-Jul-2002; LatestRevisionNote: Re-released for DXP Platform.; Publisher: Altium Limited
P28 = Header 2: Header, 2-Pin; LatestRevisionDate: 17-Jul-2002; LatestRevisionNote: Re-released for DXP Platform.; Publisher: Altium Limited
M1 = NRF24L01: Local Supplier Link: https://hshop.vn/products/mach-thu-phat-nrf24l01-pa-2-4ghzcu-khech-dai-cung-suat-thu-phat; Local Supplier: HShop; Local Supplier Part Number: HS000888; Manufacturer: *; Manufacturer Part Number: *
M2 = LC12S: Local Supplier Link: https://hshop.vn/products/mach-thu-phat-rf-uart-lc12s-2-4ghz?fbclid=IwAR3h1hU0io-Cc4GBL9Q-KMB_-TKtvE-b63OAEmRNHthVrXHliy_JpDId3Yg; Local Supplier: HShop; Local Supplier Part Number: HS00095; Manufacturer: *; Manufacturer Part Number: *
M3 = HC-12: Local Supplier: HShop; Local Supplier Link: https://hshop.vn/products/mach-thu-phat-rf-uart-si4463-433mhzkhoang-coch-1km; Local Supplier Part Number: HS000897; Manufacturer: *; Manufacturer Part Number: *
M4 = Holybro Radio: Local Supplier: *; Local Supplier Link: https://www.lazada.vn/products/ld-holybro-433mhz-915-mhz-500-mw-thu-phat-vo-tuyen-xa-bo-v3-cho-pixhawk-4-dieu-khien-chuyen-bay-i430804435-s768474304.html?spm=a2o4n.searchlist.list.4.25396b19yIS9XO&search=1; Local Supplier Part Number: *; Manufacturer: *; Manufacturer Part Number: *

## Sheet Sensor.SchDoc
size A
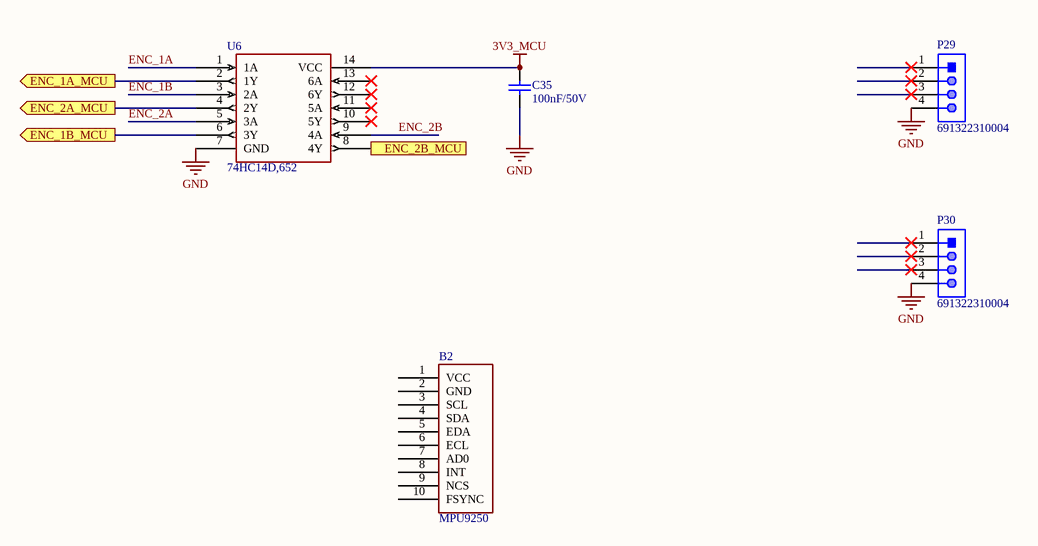
[diagram p5: Sensor.SchDoc]

### Parts
B2  MPU9250  [MPU9250]
C35  value 100nF/50V  [CAP-SM-0805]  (hidden comment: Cap-100nF-50V-0805)
P29  691322310004  [691322310004]
P30  691322310004  [691322310004]
U6  74HC14D,652  [SOT108-1_NEX]

### Ports
ENC_1A_MCU (out), ENC_1B_MCU (out), ENC_2A_MCU (out), ENC_2B_MCU (out)

### Nets
3V3_MCU: C35.2 U6.14(VCC)  [project net 3V3_MC]
GND: C35.1 P29.4 P30.4 U6.7(GND)
ENC_1A: U6.1(1A)
ENC_1B: U6.3(2A)
ENC_2A: U6.5(3A)
ENC_2B: U6.9(4A)
NetU3_16: U6.2(1Y) ; port ENC_1A_MCU
NetU3_17: U6.6(3Y) ; port ENC_1B_MCU
NetU3_42: U6.8(4Y) ; port ENC_2B_MCU
NetU3_43: U6.4(2Y) ; port ENC_2A_MCU

Not connected (* = marked no-connect by the designer): B2 1(VCC) 2(GND) 3(SCL) 4(SDA) 5(EDA) 6(ECL) 7(AD0) 8(INT) 9(NCS) 10(FSYNC); P29 1* 2* 3*; P30 1* 2* 3*; U6 10(5Y)* 11(5A)* 12(6Y)* 13(6A)*

### Library data of the parts
C35 = Cap-100nF-50V-0805: as C8 on sheet PIF_robot; Local Supplier: thegioiic; Local Supplier Link: https://thegioiic.com/products/tu-100nf-0-1uf-50v-0805; Supplier 1: Digikey; Supplier 1 Part Number: 1276-1007-1-ND; Supplier 1 Link: https://www.digikey.com/product-detail/en/samsung-electro-mechanics/CL21F104ZBCNNNC/1276-1007-1-ND/3889093
P29 P30 = 691322310004: as P23 on sheet Motor Control; ComponentLink1Description: Manufacturer; ComponentLink1URL: http://www.we-online.de; ComponentLink2URL: https://katalog.we-online.de/em/datasheet/691322310004.pdf; ComponentLink2Description: Datasheet; Mounting Technology: THT; Part Number: 691322310004; Packaging: Box; Operating Temperature: -40 to +105degC; PCB/Cable/Panel: PCB; Pitch: 3.81mm; Published Date: October 2019; Type: Horizontal; Publisher: Wurth Elektronik; Application: Pluggable

## Sheet XCBMPUSche.schdoc
size A4
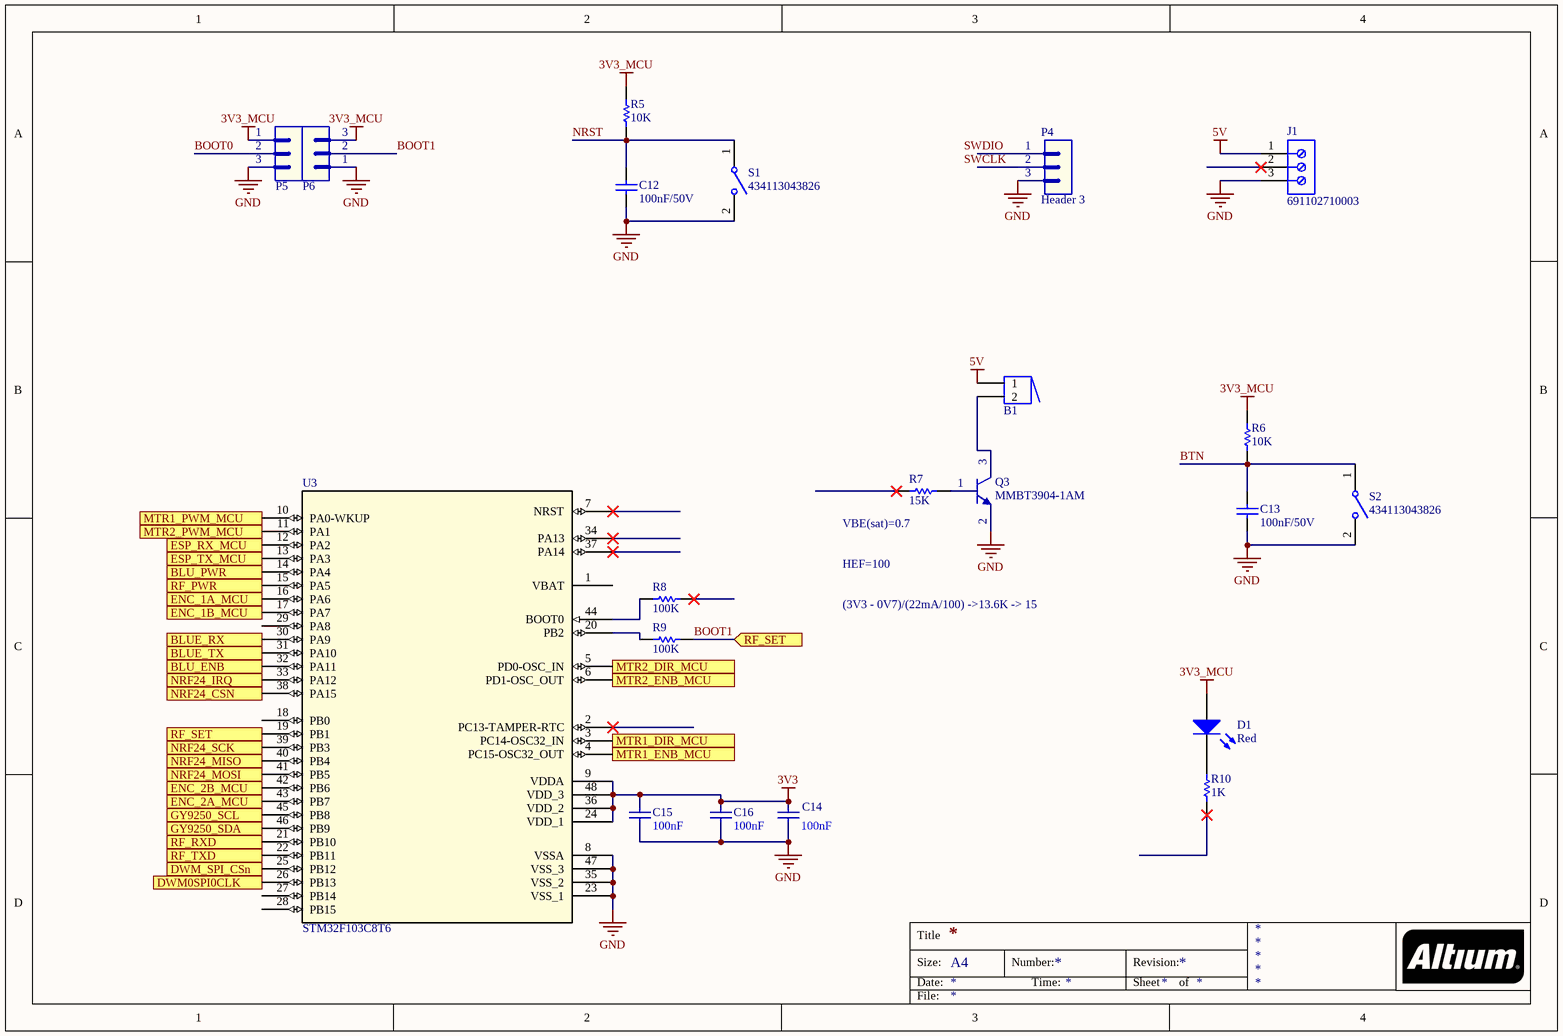
[diagram p6: XCBMPUSche.schdoc]

### Parts
B1  Buzzer  [BUZZER]  (value not drawn)
C12  value 100nF/50V  [CAP-SM-0805]  (hidden comment: Cap-100nF-50V-0805)
C13  value 100nF/50V  [CAP-SM-0805]  (hidden comment: Cap-100nF-50V-0805)
C14  value 100nF  [CN1]  (hidden comment: Cap Non-Pol)
C15  value 100nF  [CN1]  (hidden comment: Cap Non-Pol)
C16  value 100nF  [CN1]  (hidden comment: Cap Non-Pol)
D1  value Red  [LED-3mm]  (hidden comment: LED-RED-TH-3mm)
J1  691102710003  [691102710003]
P4  Header 3  [JP3]
P5  Header 3  [JP3]  (value not drawn)
P6  Header 3  [JP3]  (value not drawn)
Q3  MMBT3904-1AM  [SOT23_NEX]
R5  value 10K  [RES-SM-0805]  (hidden comment: Res-10k-0805)
R6  value 10K  [RES-SM-0805]  (hidden comment: Res-10k-0805)
R7  value 15K  [RES-SM-0805]  (hidden comment: Res-15K-0805)
R8  value 100K  [RES-SM-0805]  (hidden comment: Res-100K-0805)
R9  value 100K  [RES-SM-0805]  (hidden comment: Res-100K-0805)
R10  value 1K  [RES-SM-0805]  (hidden comment: Res-1K-0805)
S1  434113043826  [434113043826]
S2  434113043826  [434113043826]
U3  STM32F103C8T6  [STM32F103C8T6]

### Ports
BLU_ENB (out), BLU_PWR (out), BLUE_RX (out), BLUE_TX, DWM0SPI0CLK (out), DWM_SPI_CSn (out), ENC_1A_MCU, ENC_1B_MCU, ENC_2A_MCU, ENC_2B_MCU, ESP_RX_MCU (out), ESP_TX_MCU (out), GY9250_SCL (out), GY9250_SDA (out), MTR1_DIR_MCU (out), MTR1_ENB_MCU (out), MTR1_PWM_MCU (out), MTR2_DIR_MCU (out), MTR2_ENB_MCU (out), MTR2_PWM_MCU, NRF24_CSN (out), NRF24_IRQ, NRF24_MISO, NRF24_MOSI (out), NRF24_SCK (out), RF_PWR, RF_RXD (out), RF_SET (in), RF_SET (out), RF_TXD

### Nets
3V3: C14.2 C15.2 C16.2 U3.9(VDDA) U3.24(VDD_1) U3.36(VDD_2) U3.48(VDD_3)
3V3_MCU: D1.1(A) P5.1 P6.3 R5.2 R6.2  [project net 3V3_MC]
5V: B1.1 J1.1
GND: C12.1 C13.1 C14.1 C15.1 C16.1 J1.3 P4.3 P5.3 P6.1 Q3.2(E) S1.2 S2.2 U3.8(VSSA) U3.23(VSS_1) U3.35(VSS_2) U3.47(VSS_3)
BOOT0: P5.2
BOOT1: P6.2 R9.2 U3.19(PB1) ; port RF_SET
BTN: C13.2 R6.1 S2.1
DWM_SPI_CSn: U3.25(PB12) ; port DWM_SPI_CSn
NRST: C12.2 R5.1 S1.1
Net1_25: U3.13(PA3) ; port ESP_TX_MCU
NetB1_2: B1.2 Q3.3(C)
NetD1_2: D1.2(K) R10.2
NetM1_4: U3.38(PA15) ; port NRF24_CSN
NetM1_5: U3.39(PB3) ; port NRF24_SCK
NetM1_6: U3.41(PB5) ; port NRF24_MOSI
NetM1_7: U3.40(PB4) ; port NRF24_MISO
NetM1_8: U3.33(PA12) ; port NRF24_IRQ
NetM2_2: U3.21(PB10) ; port RF_RXD
NetM2_3: U3.22(PB11) ; port RF_TXD
NetQ3_1: Q3.1(B) R7.2
NetR3_1: U3.14(PA4) ; port BLU_PWR
NetR4_1: U3.15(PA5) ; port RF_PWR
NetR8_1: R8.1 U3.44(BOOT0)
NetR9_1: R9.1 U3.20(PB2)
NetR18_1: U3.12(PA2) ; port ESP_RX_MCU
NetU3_3: U3.3(PC14-OSC32_IN) ; port MTR1_DIR_MCU
NetU3_4: U3.4(PC15-OSC32_OUT) ; port MTR1_ENB_MCU
NetU3_5: U3.5(PD0-OSC_IN) ; port MTR2_DIR_MCU
NetU3_6: U3.6(PD1-OSC_OUT) ; port MTR2_ENB_MCU
NetU3_10: U3.10(PA0-WKUP) ; port MTR1_PWM_MCU
NetU3_11: U3.11(PA1) ; port MTR2_PWM_MCU
NetU3_16: U3.16(PA6) ; port ENC_1A_MCU
NetU3_17: U3.17(PA7) ; port ENC_1B_MCU
NetU3_26: U3.26(PB13) ; port DWM0SPI0CLK
NetU3_30: U3.30(PA9) ; port BLUE_RX
NetU3_31: U3.31(PA10) ; port BLUE_TX
NetU3_32: U3.32(PA11) ; port BLU_ENB
NetU3_42: U3.42(PB6) ; port ENC_2B_MCU
NetU3_43: U3.43(PB7) ; port ENC_2A_MCU
NetU3_45: U3.45(PB8) ; port GY9250_SCL
NetU3_46: U3.46(PB9) ; port GY9250_SDA

Not connected (* = marked no-connect by the designer): J1 2*; P4 1 2; R7 1*; R8 2*; R10 1*; U3 1(VBAT) 2(PC13-TAMPER-RTC)* 7(NRST)* 18(PB0) 27(PB14) 28(PB15) 29(PA8) 34(PA13)* 37(PA14)*

### Notes on the sheet
- (near R7) VBE(sat)=0.7
- HEF=100
- (3V3 - 0V7)/(22mA/100) ->13.6K -> 15
- Labels drawn without touching a wire or pin: SWCLK, SWDIO
- Title
- Size:
- Date:
- A4
- Number:
- Time:
- Revision:
- Sheet
- of
- File:

### Library data of the parts
C12 C13 = Cap-100nF-50V-0805: as C8 on sheet PIF_robot; Local Supplier: thegioiic; Local Supplier Link: https://thegioiic.com/products/tu-100nf-0-1uf-50v-0805; Supplier 1: Digikey; Supplier 1 Part Number: 1276-1007-1-ND; Supplier 1 Link: https://www.digikey.com/product-detail/en/samsung-electro-mechanics/CL21F104ZBCNNNC/1276-1007-1-ND/3889093
C14-C16 = Cap-TH-NonPol: Capacitor
D1 = LED-RED-TH-3mm: LED RED CLEAR T-1 T/H; Manufacturer: Kingbright; Manufacturer Part Number: WP710A10SEC/J3; Local Supplier: thegioiic; Local Supplier Link: https://thegioiic.com/products/led-do-3mm-chan-dai; Supplier 1: Digikey; Supplier 1 Link: https://www.digikey.com/product-detail/en/kingbright/WP710A10SEC-J3/754-1589-ND/2769815; Supplier 1 Part Number: 754-1589-ND
J1 = 691102710003: WR-TBL Serie 102 Horizontal Entry Modular, Pressure Clamp, pitch 5mm, 3p; Compliance: Lead free / RoHS; Modularity: Yes; PCB/Cable/Panel: PCB; Pin Number: 3; Rated Current [UL]: 15A; Working Voltage [UL]: 250VAC; ComponentLink1Description: Manufacturer; ComponentLink1URL: http://www.we-online.de; ComponentLink2URL: https://katalog.we-online.de/em/datasheet/691102710003.pdf; ComponentLink2Description: Datasheet; Mounting Technology: THT; Part Number: 691102710003; Packaging: Box; Operating Temperature: -40 to +105degC; Pitch: 5mm; Published Date: October 2019; Type: Horizontal; Publisher: Wurth Elektronik; Application: Pressure Clamp
P4-P6 = Header 3: Header, 3-Pin; LatestRevisionDate: 17-Jul-2002; LatestRevisionNote: Re-released for DXP Platform.; Publisher: Altium Limited
R5 R6 = Res-10k-0805: as R26 on sheet Decawave; Local Supplier: thegioiic; Local Supplier Link: https://thegioiic.com/products/dien-tro-10k-ohm-0805-5; Supplier 1: Digikey; Supplier 1 Link: https://www.digikey.com/product-detail/en/stackpole-electronics-inc/RNCP0805FTD10K0/RNCP0805FTD10K0CT-ND/2240601; Supplier 1 Part Number: RNCP0805FTD10K0CT-ND
R7 = Res-15K-0805: RES 15K OHM 1% 1/4W 0805; Manufacturer: TE Connectivity Passive Product; Manufacturer Part Number: CRGCQ0805F15K; Local Supplier: thegioiic; Local Supplier Link: https://thegioiic.com/products/dien-tro-15k-ohm-0805-1; Supplier 1: Digikey; Supplier 1 Part Number: A129763CT-ND; Supplier 1 Link: https://www.digikey.com/product-detail/en/te-connectivity-passive-product/CRGCQ0805F15K/A129763CT-ND/8577595
R8 R9 = Res-100K-0805: as R3 on sheet PIF_robot; Local Supplier: thegioiic; Local Supplier Link: https://thegioiic.com/products/dien-tro-0-ohm-0805-5; Supplier 1: Digikey; Supplier 1 Link: https://www.digikey.com/product-detail/en/vishay-dale/WSL080500000ZEA9/541-3928-1-ND/7423223; Supplier 1 Part Number: 541-3928-1-ND
R10 = Res-1K-0805: as R18 on sheet wifi; Local Supplier: thegioiic; Local Supplier Link: https://thegioiic.com/products/dien-tro-1k-ohm-0805-5; Supplier 1: Digikey; Supplier 1 Link: https://www.digikey.com/product-detail/en/stackpole-electronics-inc/RNCP0805FTD1K00/RNCP0805FTD1K00CT-ND/2240568; Supplier 1 Part Number: RNCP0805FTD1K00CT-ND
S1 S2 = 434113043826: as S3 on sheet Decawave; ComponentLink1Description: Manufacturer; ComponentLink1URL: http://www.we-online.de; ComponentLink2Description: Datasheet; ComponentLink2URL: https://katalog.we-online.com/em/datasheet/434113043826.pdf; Operating Temperature: -40 to +85degC; Part Number: 434113043826; Published Date: September 2019; Contact Material: Stainless Steel; Height: 4.3mm; Mounting Technology: SMT; Contact Plating: Silver; Operation Force: 260gf; Packaging: Tape and Reel; Terminal Material: Copper Alloy; Publisher: Wurth Elektronik; Terminal Plating: Silver
U3 = STM32F103C8T6: No Description Available; SourceLibrary: StMicro_2011-06-07; Built_By: EMA_UL_Team; Vendor: STMicroelectronics; Manufacturer_Part_Number: STM32F103C8T6; Copyright: Copyright (C) 2018 Accelerated Designs. All rights reserved; RefDes: RefDes; Type: DEV

## Nets that join several sheets
3V3_DWM: PIF_robot (C7.2 IC3.2 IC3.4), Decawave (P10.2)
3V3_MC: PIF_robot (C5.2 C6.2 IC2.2 IC2.4), Motor Control (P21.1), Sensor (C35.2 U6.14), XCBMPUSche (5 pins)
3V3_RF: PIF_robot (C11.2 U2.5), RF (7 pins)
5V: PIF_robot (12 pins), Motor Control (P21.3), XCBMPUSche (B1.1 J1.1)
12V: PIF_robot (*1.1 C1.1 C2.1 P2.1), Motor Control (P20.1 P22.1)
GND: PIF_robot (20 pins), wifi (14 pins), Decawave (16 pins), Motor Control (5 pins), RF (9 pins), Sensor (C35.1 P29.4 P30.4 U6.7), XCBMPUSche (16 pins)
BOOT1: RF (M2.4 M3.5 P27.3), XCBMPUSche (P6.2 R9.2 U3.19)
DWM_SPI_CSn: Decawave (P9.2 U7.29), XCBMPUSche (U3.25)
Net1_25: wifi (1.25 *2.22), XCBMPUSche (U3.13)
NetM1_4: RF (M1.4), XCBMPUSche (U3.38)
NetM1_5: RF (M1.5), XCBMPUSche (U3.39)
NetM1_6: RF (M1.6), XCBMPUSche (U3.41)
NetM1_7: RF (M1.7), XCBMPUSche (U3.40)
NetM1_8: RF (M1.8), XCBMPUSche (U3.33)
NetM2_2: RF (M2.2 M3.3 M4.2 P27.5), XCBMPUSche (U3.21)
NetM2_3: RF (M2.3 M3.4 M4.3 P27.4), XCBMPUSche (U3.22)
NetR3_1: PIF_robot (R3.1), XCBMPUSche (U3.14)
NetR4_1: PIF_robot (R4.1), XCBMPUSche (U3.15)
NetR18_1: wifi (R18.1), XCBMPUSche (U3.12)
NetU3_3: Motor Control (U5.3), XCBMPUSche (U3.3)
NetU3_4: Motor Control (U5.6), XCBMPUSche (U3.4)
NetU3_5: Motor Control (U5.5), XCBMPUSche (U3.5)
NetU3_6: Motor Control (U5.7), XCBMPUSche (U3.6)
NetU3_10: Motor Control (U5.2), XCBMPUSche (U3.10)
NetU3_11: Motor Control (U5.4), XCBMPUSche (U3.11)
NetU3_16: Sensor (U6.2), XCBMPUSche (U3.16)
NetU3_17: Sensor (U6.6), XCBMPUSche (U3.17)
NetU3_42: Sensor (U6.8), XCBMPUSche (U3.42)
NetU3_43: Sensor (U6.4), XCBMPUSche (U3.43)